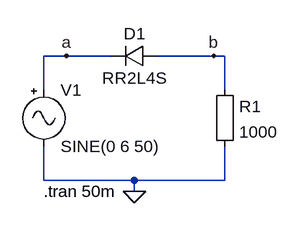
[diagram p0: schematic RN-1.asc]
RN-1.asc, the LTspice schematic file:
Version 4
SHEET 1 880 680
WIRE -176 144 -208 144
WIRE -112 144 -176 144
WIRE 32 144 -48 144
WIRE 48 144 32 144
WIRE -208 192 -208 144
WIRE 48 192 48 144
WIRE -208 320 -208 272
WIRE -80 320 -208 320
WIRE 48 320 48 272
WIRE 48 320 -80 320
WIRE -80 336 -80 320
FLAG -80 336 0
FLAG -176 144 a
FLAG 32 144 b
SYMBOL diode -48 128 R90
WINDOW 0 0 32 VBottom 2
WINDOW 3 32 32 VTop 2
SYMATTR InstName D1
SYMATTR Value RR2L4S
SYMBOL Misc\\EuropeanResistor 32 176 R0
SYMATTR InstName R1
SYMATTR Value 1000
SYMBOL Misc\\signal -208 176 R0
WINDOW 123 0 0 Left 2
WINDOW 39 0 0 Left 2
SYMATTR InstName V1
SYMATTR Value SINE(0 6 50)
TEXT -208 336 Left 2 !.tran 50m

The netlist it stands for:
* RN-1.asc
D1 b a RR2L4S
R1 b 0 1000
V1 a 0 SINE(0 6 50)
.model D D
.lib standard.dio
.tran 50m
.backanno
.end